# EAGLE design RP2040-Shim-2 (EAGLE 7.7.0)
COMPANY: ADAFRUIT INDUSTRIES; DRAWN: KTOWN; REV: B
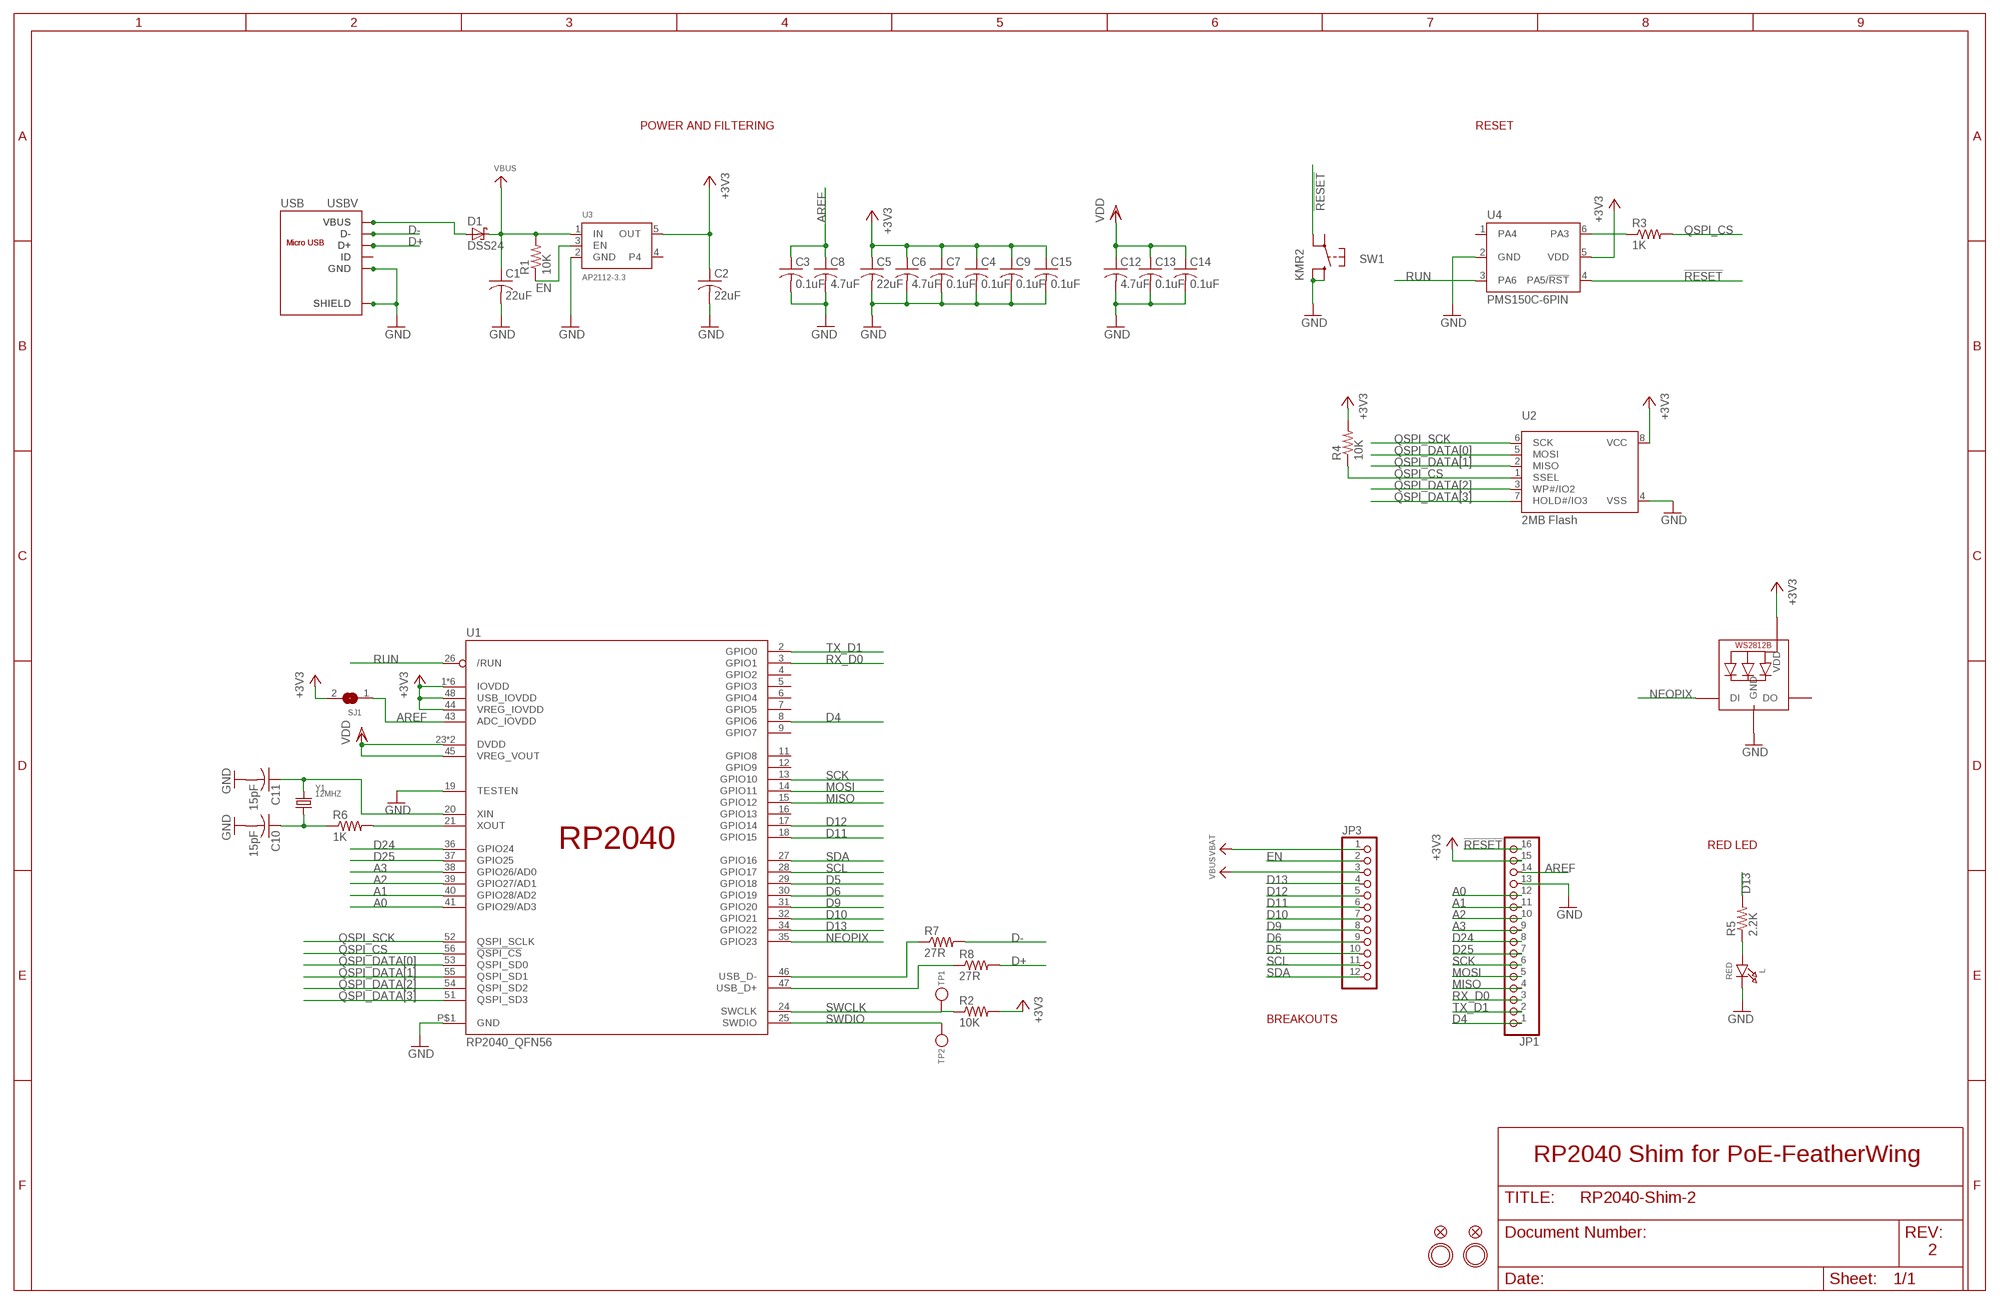
[diagram p0: schematic, sheet 1]

## Parts
C1  22uF  C-USC0805K  [C0805K]
C2  22uF  C-USC0805K  [C0805K]
C3  0.1uF  C-USC0402K  [C0402K]
C4  0.1uF  C-USC0402K  [C0402K]
C5  22uF  C-USC0805K  [C0805K]
C6  4.7uF  C-USC0402K  [C0402K]
C7  0.1uF  C-USC0402K  [C0402K]
C8  4.7uF  C-USC0402K  [C0402K]
C9  0.1uF  C-USC0402K  [C0402K]
C10  15pF  C-USC0402K  [C0402K]
C11  15pF  C-USC0402K  [C0402K]
C12  4.7uF  C-USC0402K  [C0402K]
C13  0.1uF  C-USC0402K  [C0402K]
C14  0.1uF  C-USC0402K  [C0402K]
C15  0.1uF  C-USC0402K  [C0402K]
D1  DSS24  [SOD123FL]
JP1  HEADER-1X16ROUND  [1X16_ROUND]
JP3  HEADER-1X12  [1X12_ROUND]
L  RED  LED0805_NOOUTLINE  [CHIPLED_0805_NOOUTLINE]
LED1  WS2812B3535  [LED3535]
R1  10K  R-US_R0402  [R0402]
R2  10K  R-US_R0402  [R0402]
R3  1K  R-US_R0402  [R0402]
R4  10K  R-US_R0402  [R0402]
R5  2.2K  R-US_R0402  [R0402]
R6  1K  R-US_R0402  [R0402]
R7  27R  R-US_R0402  [R0402]
R8  27R  R-US_R0402  [R0402]
SJ1  SOLDERJUMPERCLOSED  [SOLDERJUMPER_CLOSEDWIRE]
SW1  KMR2  SWITCH_TACT_SMT4.6X2.8  [BTN_KMR2_4.6X2.8]
TP1  TESTPOINTROUND1.5MM  [TESTPOINT_ROUND_1.5MM]
TP2  TESTPOINTROUND1.5MM  [TESTPOINT_ROUND_1.5MM]
U1  RP2040_QFN56  [QFN56_7MM_REDUCEDEPAD]
U2  2MB Flash  SPIFLASH_8PINUX  [USON8]
U3  AP2112-3.3  VREG_SOT23-5  [SOT23-5]
U4  PMS150C-6PIN  [SOT23-6]
U$31  MOUNTINGHOLE2.5  [MOUNTINGHOLE_2.5_PLATED]
U$32  MOUNTINGHOLE2.5  [MOUNTINGHOLE_2.5_PLATED]
U$34  FIDUCIAL_1MM  [FIDUCIAL_1MM]
U$35  FIDUCIAL_1MM  [FIDUCIAL_1MM]
USB  ZX62-B-5PA  MICRO-USB-SMD  [TS-1012E-AC03516]
USBV  MICRO-USB-SMD-VERT  [U-D-M5DS-W-4]
Y1  12MHZ  CRYSTAL2.5X2.0  [CRYSTAL_2.5X2]

## Nets
!RESET: JP1.16 SW1.A'(P1) U4.4(PA5/!RST)
+3V3 [power]: C2.1 C4.1 C5.1 C6.1 C7.1 C9.1 C15.1 JP1.15 LED1.2(VDD) R2.2 R4.2 SJ1.2 U1.1(IOVDD) U1.10(IOVDD) U1.22(IOVDD) U1.33(IOVDD) U1.42(IOVDD) U1.44(VREG_IOVDD) U1.48(USB_IOVDD) U1.49(IOVDD) U2.8(VCC) U3.5(OUT) U4.5(VDD)
A0: JP1.12 U1.41(GPIO29/AD3)
A1: JP1.11 U1.40(GPIO28/AD2)
A2: JP1.10 U1.39(GPIO27/AD1)
A3: JP1.9 U1.38(GPIO26/AD0)
AREF: C3.1 C8.1 JP1.14 SJ1.1 U1.43(ADC_IOVDD)
D4: JP1.1 U1.8(GPIO6)
D5: JP3.10 U1.29(GPIO18)
D6: JP3.9 U1.30(GPIO19)
D9: JP3.8 U1.31(GPIO20)
D10: JP3.7 U1.32(GPIO21)
D11: JP3.6 U1.18(GPIO15)
D12: JP3.5 U1.17(GPIO14)
D13: JP3.4 R5.2 U1.34(GPIO22)
D24: JP1.8 U1.36(GPIO24)
D25: JP1.7 U1.37(GPIO25)
D+: R8.2 USB.3(D+) USBV.3(D+)
D-: R7.2 USB.2(D-) USBV.2(D-)
EN: JP3.2 R1.1 U3.3(EN)
GND [gnd]: C1.2 C2.2 C3.2 C4.2 C5.2 C6.2 C7.2 C8.2 C9.2 C10.2 C11.2 C12.2 C13.2 C14.2 C15.2 JP1.13 L.C LED1.4(GND) SW1.B'(S1) SW1.B(S) U1.19(TESTEN) U1.P$1(GND) U2.4(VSS) U3.2(GND) U4.2(GND) USB.5(GND) USB.P1(SHIELD) USB.P2(SHIELD) USB.P3(SHIELD) USB.P4(SHIELD) USB.P5(SHIELD) USB.P6(SHIELD) USBV.5(GND) USBV.MNT1(SHIELD) USBV.MNT2(SHIELD) USBV.MNT3(SHIELD) USBV.MNT4(SHIELD)
MISO: JP1.4 U1.15(GPIO12)
MOSI: JP1.5 U1.14(GPIO11)
N$1: USB.4(ID) USBV.4(ID)
N$2: L.A R5.1
N$5: C10.1 R6.1 Y1.1
N$6: R6.2 U1.21(XOUT)
N$7: C11.1 U1.20(XIN) Y1.3
N$8: R8.1 U1.47(USB_D+)
N$9: R7.1 U1.46(USB_D-)
N$11: R3.1 U4.6(PA3)
NEOPIX: LED1.1(DI) U1.35(GPIO23)
QSPI_CS: R3.2 R4.1 U1.56(!QSPI_CS) U2.1(SSEL)
QSPI_DATA[0]: U1.53(QSPI_SD0) U2.5(MOSI)
QSPI_DATA[1]: U1.55(QSPI_SD1) U2.2(MISO)
QSPI_DATA[2]: U1.54(QSPI_SD2) U2.3(WP#/IO2)
QSPI_DATA[3]: U1.51(QSPI_SD3) U2.7(HOLD#/IO3)
QSPI_SCK: U1.52(QSPI_SCLK) U2.6(SCK)
RUN: U1.26(/RUN) U4.3(PA6)
RX_D0: JP1.3 U1.3(GPIO1)
SCK: JP1.6 U1.13(GPIO10)
SCL: JP3.11 U1.28(GPIO17)
SDA: JP3.12 U1.27(GPIO16)
SWCLK: R2.1 TP1.P$1 U1.24(SWCLK)
SWDIO: TP2.P$1 U1.25(SWDIO)
TX_D1: JP1.2 U1.2(GPIO0)
VBAT [power]: JP3.1
VBUS [power]: C1.1 D1.C JP3.3 R1.2 U3.1(IN)
VBUSEXT [power]: D1.A USB.1(VBUS) USBV.1(VBUS)
VDD: C12.1 C13.1 C14.1 U1.23(DVDD) U1.45(VREG_VOUT) U1.50(DVDD)
Unconnected: LED1.3(DO) SW1.A(P) U1.4(GPIO2) U1.5(GPIO3) U1.6(GPIO4) U1.7(GPIO5) U1.9(GPIO7) U1.11(GPIO8) U1.12(GPIO9) U1.16(GPIO13) U3.4 U4.1(PA4)

## Notes on the sheet
- POWER AND FILTERING | RESET
- RED LED
- BREAKOUTS
- RP2040 Shim for PoE-FeatherWing
- 2

## Library data of the parts
C1-C15 = rcl:C-US: CAPACITOR, American symbol
D1 = LiFePO4wered-ESP32:DSS24: DSS22-DSS225 https://datasheet.lcsc.com/szlcsc/DIYI-Elec-Tech-D24_C150988.pdf
JP1 = microbuilder:HEADER-1X16: PIN HEADER
JP3 = microbuilder:HEADER-1X12
L = microbuilder:LED: LED 0603 - 0603 Surface Mount Package 2mA: Green LED - Low Power (3.9mcd, 2ma, 1.7Vf) - Digikey: 475-2709-2-ND Orange LED - Low Power (9.8mcd, 2ma, 1.8Vf) - Digikey: 475-1194-2-ND Red LED - Low Power (5mcd, 2ma, 1.8Vf) - Digikey: 475-1195-2-ND Yellow LED - Low Power (7mcd, 2ma, 1.8Vf) - Digikey: 475-1196-2-ND 5mA: Blue LED - Low Power (17mcd, 5ma, 2.9Vf) - Digikey: LNJ937W8CRACT-ND 0805 - 0805 Surface Mount Package 2mA: Red LED (8.8mcd, 2mA, 1.8Vf, Clear) - Low Power [Digikey: 475-2510-1-ND] Green LED (5mcd, 2mA, 1.8Vf, Clear) - Low Power [Digikey: 475-2730-1-ND] Yellow LED (11.3mcd, 2mA, 1.8Vf, Clear) - Low Power [Digikey: 475-2555-1-ND] 20mA: Red LED (104mcd, 20mA, Diffused) - LS R976 [Digikey: 475-1278-6-ND] Red LED (12mcd, 20mA, 2.0Vf, Clear) - APT2012EC [Digikey: 754-1128-1-ND] Green LED (15mcd, 20mA, 2.2Vf, Clear) - APT2012GC [Digikey: 754-1131-1-ND] Orange LED (160mcd, 20mA, 2.1Vf, Clear) - APT2012SECK [Digikey: 754-1130-1-ND] 1206 - 1206 Surface Mount Package Green LED (26mcd, 20mA, Diffused) - LG N971 [Digikey: 475-1407-6-ND] Red LED (15mcd, 20mA, Diffused) - LH N974 [Digikey: 475-1416-6-ND] Cree - Cree High-Power Surface Mount LEDs XPEBWT-L1-0000-00D50 - White 111lm 350mA 2.9Vf 6200K 110° XTEAWT-00-0000-00000LEE3 - White 114lm 350mA 2.85Vf 5000K 115° Everlight - Everlight 45-21 Series Surface Mount LEDs 45-21/QK2C-B2832AC2CB2/2T - Warm White 2000mcd 20mA 3.25Vf 3050K 120° 45-21/LK2C-B38452C4CB2/2T - Nuetral White 2000mcd 20mA 3.25Vf 4150K 120° 45-21/LK2C-B50634C6CB2/2T - Cold White 2200mcd 20mA 3.25Vf 5650K 120° PLCC2 Reverse Mount LS T77K-J1L2-1-0-2-R18-Z - Red 11.25mcd 2mA 1.8Vf 630nm 120° LO T77K-L1M2-24-Z - Orange 19.6mcd 2mA 1.8Vf 606nm 120° LY T77K-K2M1-26-Z - Yellow 15.7mcd 2mA 1.8Vf 587nm 120°
LED1 = microbuilder:WS2812B
R1-R8 = rcl:R-US_: RESISTOR, American symbol
SJ1 = microbuilder:SOLDERJUMPER: SMD Solder JUMPER Solder the two pads together to create a connection, or remove the solder to break it. REFLOW - Use this footprint for solder paste and reflow ovens. WAVE - Use this footprint for hand-soldering (larger pads). CLOSED - Has a trace between the two pads to ensure it is closed by default. The trace needs to be cut to disable the jumper, and can be closed again by creating a solder bridge between the two pads.
SW1 = microbuilder:SWITCH_TACT_SMT: SMT Tact Switches 6x6mm - Digikey: P12940SCT-ND KMR2 (4.6x2.8mm) - Digikey: 401-1426-1-ND EVQ-PQHB55 - Light Touch, 160GF (4.5x4.5mm) - Digikey: P8090SCT-ND KMT0 - KMT021 NGJ LHS (etc.) IP68/Waterproof - Digikey: CKN10289CT-ND
TP1 TP2 = microbuilder:TESTPOINT: Test Point Various test points for characterisation and PCB testing TESTPOINT_SMT - Compact Surface Mount Test Point [Digikey: 5016KTR-ND]
U1 = adafruit_micro:RP2040
U2 = microbuilder:SPIFLASH_8PIN: SOIC8 SPI Flash Be careful with the size since SOIC8 flash comes in several 'widths' SOIC8 150 mil M25P16 - 16Mbit (2Mbit x 8) Serial Flash (75MHz SPI Bus), Supply: 2.7-3.6V Digikey: SOIC8 - M25P16-VMN6P-ND SOIC8 208 mil W25Q16BVSSIG - 16Mbit (2Mbit x 8) Serial Flash (104MHz SPI Bus), Supply: 2.7-3.6V Digikey: SOIC8 - W25Q16BVSSIG-ND
U3 = microbuilder:VREG_SOT23-5: SOT23-5 Fixed Voltage Regulators Part Current Out V Out V In V Dropout θJA (°C/W) TJ (°C) Digikey Part No. ADP121 150mA 3.3V 3.4-5.5V 0.09V @ 150mA -- -- ADP121-AUJZ33R7CT-ND ADP121 150mA 3.0V 3.1-5.5V 0.09V @ 150mA -- -- ADP121-AUJZ30R7CT-ND ADP122 300mA 3.3V 3.4-5.5V 0.085V @ 300mA -- -- ADP122AUJZ-3.3-R7CT-ND ADP1712 300mA 3.3V 3.5-5.5V 0.17V @ 300mA -- -- ADP1712AUJZ-3.3-R7TR-ND AP7311 (Low Cost) 150mA 3.3V 3.5-6V 0.15V @ 150mA -- -- AP7311-33WG-7DICT-ND LD39015M18R 150mA 1.8V 1.9V-5.5V 0.08V @ 100mA -- -- 497-6977-1-ND LP2985A-33DBVR 150mA 3.3V 3.3-16V 0.28V @ 150mA 206 150 296-18479-1-ND MCP1824T-3302E/OT 300mA 3.3V 3.5V-6V 0.2V @ 300mA -- -- MCP1824T-3302E/OTCT-ND MIC5205-2.5YM5 TR 150mA 2.5V 2.7-16V 0.165V @ 150mA -- -- 576-1257-2-ND MIC5205-3.0YM5 TR 150mA 3.0V 3.2V-16V 0.165V @ 150mA -- -- 576-1258-2-ND MIC5205-3.3YM5 TR 150mA 3.3V 3.5V-16V 0.165V @ 150mA -- -- 576-1259-2-ND TPS780330220 150mA 3.3V+2.2V 3.6-5.5V 250mV Max -- -- 296-23332-1-ND TDA3663/N1,135 100mA 3.3V 3.5-45V 0.18V @ 50mA -- -- 568-5343-1-ND Max operating temp can be calculated using θJA, TJ (max junction temperature), and power in watts. Set the "Maximum Ambient Temperature" until it reaches TJ ("Max Junction Temperature"), which is the absolute limit for safe use of the regulator: Heat Sink Temperature Calculator <http://www.daycounter.com/Calculators/Heat-Sink-Temperature-Calculator.phtml> For example, With 12V source into a 3.3V LP2985 and a 30mA load, we are dissipating (12V-3.3V) * 0.03A = 0.261W. With a θJA of 206 °C/W, a TJ of 150°C, and 261mW we can safely use the chip without a heat sink up to 75°C (=147.1°C Junction Temperature).
U4 = wESP32:PMS150C-6PIN: Padauk PMS150C SOT23-6 http://www.padauk.com.tw/upload/doc/PMS150C%20datasheet%20V105_EN_20181128.pdf
U$31 U$32 = microbuilder:MOUNTINGHOLE: Mounting Hole For #2 screws (0.086"/2.18mm width, 0.094"/2.4mm hole) use 2.5mm; BOM: EXCLUDE
U$34 U$35 = microbuilder:FIDUCIAL: Fiducial Alignment Points Various fiducial points for machine vision alignment.; BOM: EXCLUDE
USB = PoE-FeatherWing:MICRO-USB-SMD: 320010005; MPN: ZX62-B-5PA
USBV = PoE-FeatherWing:MICRO-USB-SMD: 320010005
Y1 = microbuilder:CRYSTAL: Crystals HC49UP - Surface Mount Crystal 4.0MHz 18pF +/-30ppm Surface Mount Crystal [Digikey: 535-9857-1-ND] 12.0 MHz Surface Mount Crystal [Digikey: 535-9869-6-ND] 25.0 MHz Surface Mount Crystal [Digikey: 535-9078-1-ND] 2.5 x 2.0mm - MEMs SMT Crystal 16.0 MHz 10pF 20ppm 2.5 x 2.0mm Crystal [Digikey -40-85°C: 535-10923-1-ND] 3.2 x 2.5mm - MEMs SMT Crystal 12.0 MHz 8pF 15ppm 3.2 x 2.5mm Crystal [Digikey: -10-70°C: 644-1047-1-ND -40-125°C: 644-1128-1-ND] 40~85°C cheaper: 644-1173-6-ND 16.0 MHz 8pF 15ppm 3.2 x 2.5mm Crystal [Digikey: -10-70°C: 644-1049-1-ND -40-125°C: 644-1129-2-ND]-40~85°C cheaper: 644-1175-6-ND 16.0 MHz 10pF 10ppm 3.2 x 2.5mm Crystal [Digikey: 644-1100-1-ND] 27.12 MHz 18pF 30ppm 3.2 x 2.5mm Crystal [Digikey: 887-1424-1-ND] 27.12MHz 10pF 10ppm 3.2 x 2.5mm Crystal [Digikey: 887-1329-1-ND] 4.9 x 1.8mm - MEMs SMT Crystal 32.768 KHz 12.5pF 20ppm 4.9 x 1.8mm Crystal [Digikey: SE2415CT-ND] 8.0 x 3.8mm - Surface Mount Crystal 32.768kHz 12.5pF 20ppm -40°C-85°C [Digikey: 535-9166-2-ND] Cylinder 32.768KHz Cylinder Crystal (2x6mm body) [Ex. Digikey: 300-8341-2-ND]

## Net classes
1 power: width 0.305 mm
2 gnd: width 0.254 mm

## Board
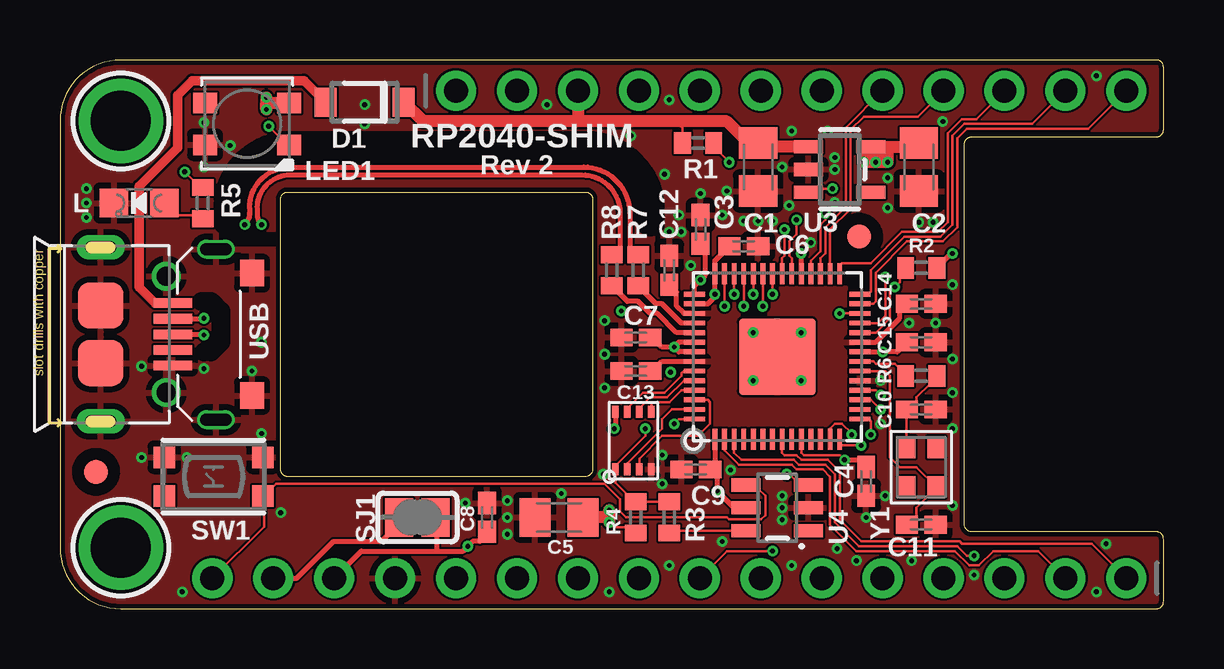
[diagram p1: board, top side]
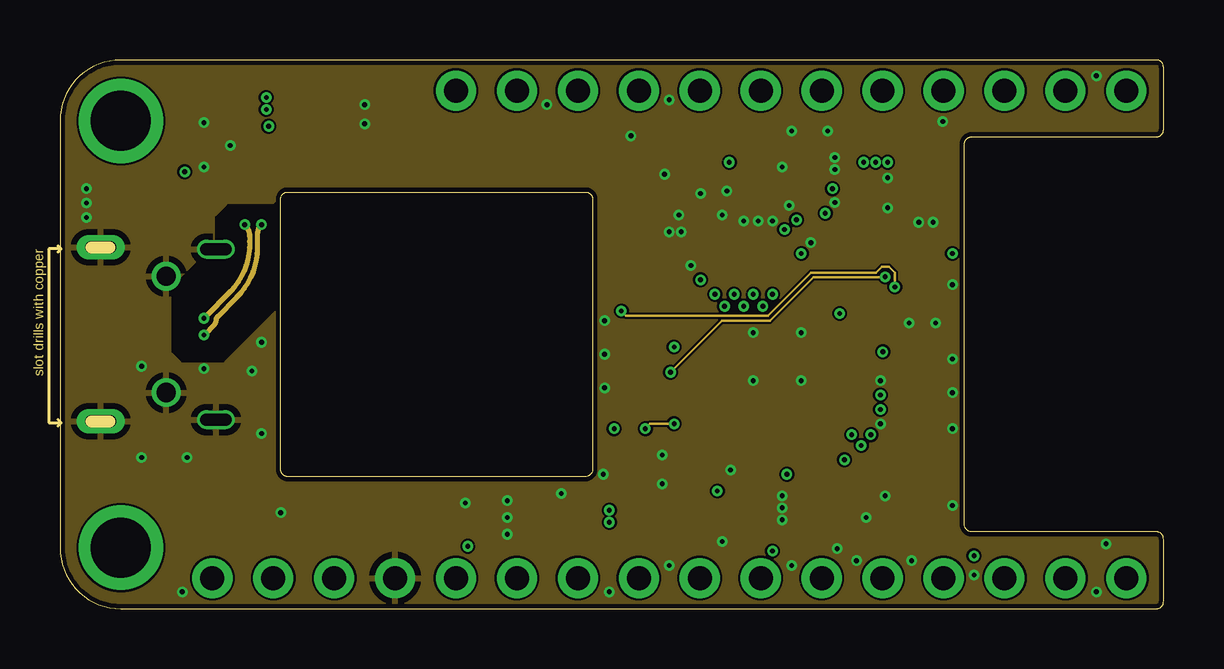
[diagram p2: board, inner layer Route2]
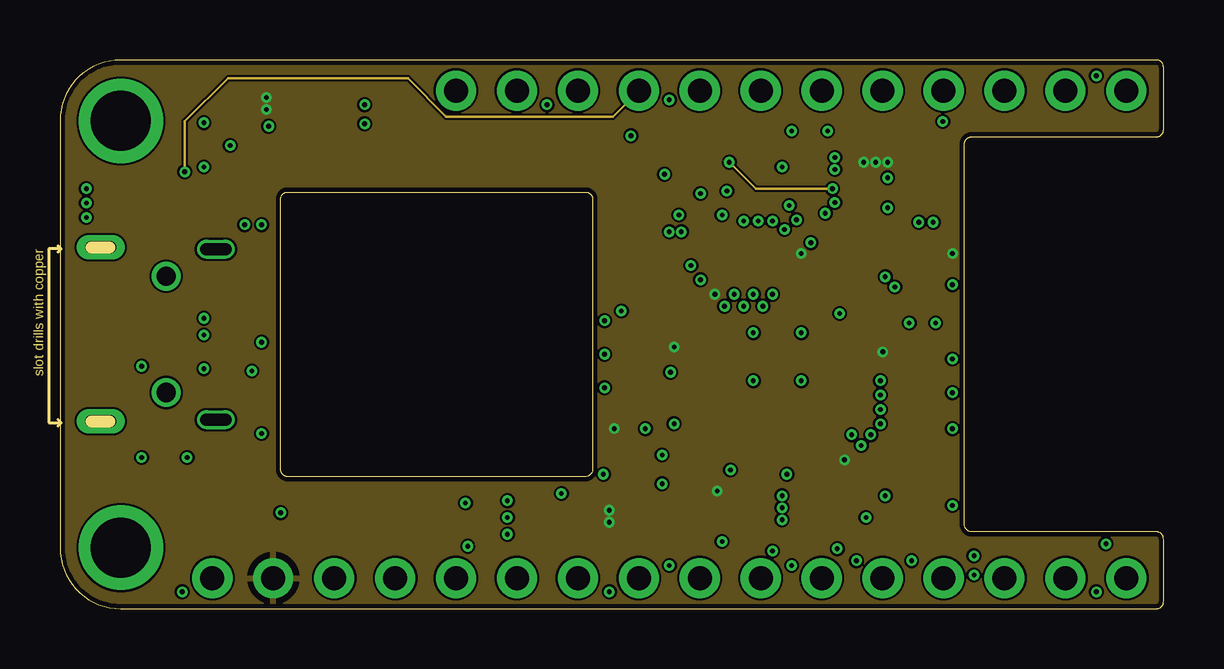
[diagram p3: board, inner layer Route3]
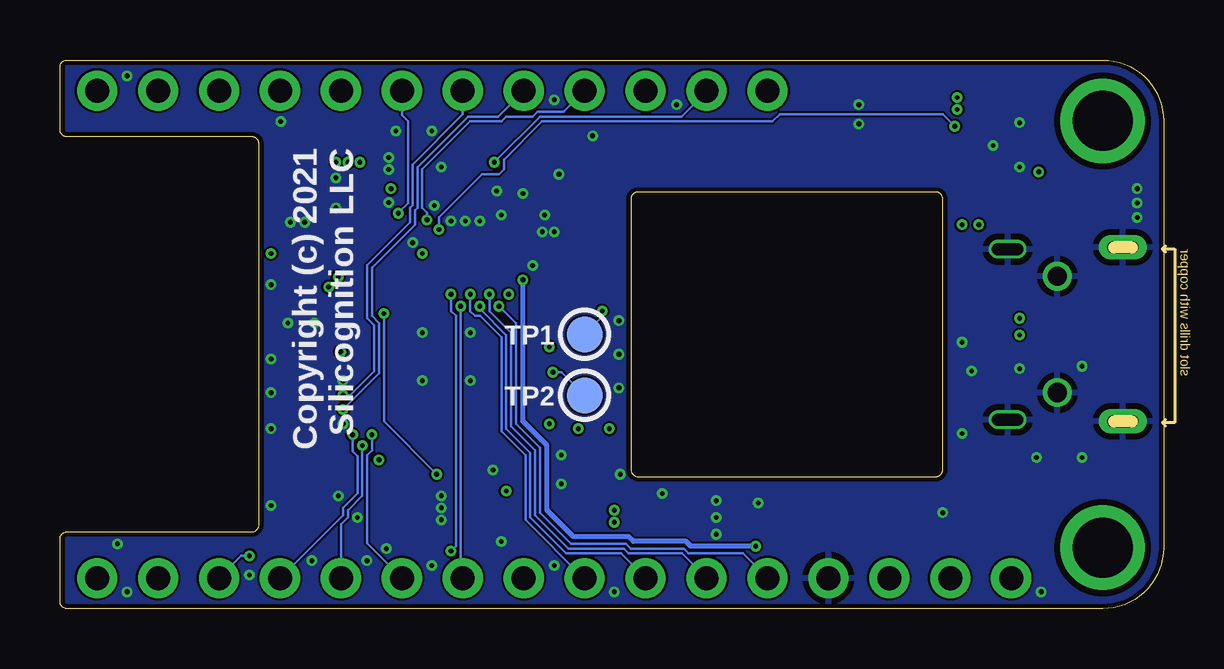
[diagram p4: board, bottom side, seen from below]

Size 46 x 22.86 mm. Coordinates in mm from the lower left corner, seen from the top.
Outline: 45.7,22.86 2.54,22.86 arc90 0,20.32 0,2.54 arc90 2.54,0 45.7,0 arc90 46,0.3 46,2.9 arc90 45.7,3.2 38,3.2 arc-90 37.7,3.5 37.7,19.36 arc-90 38,19.66 45.7,19.66 arc90 46,19.96 46,22.56 arc90 45.7,22.86
Outline: 21.9,5.5 9.5,5.5 arc-90 9.2,5.8 9.2,17.06 arc-90 9.5,17.36 21.9,17.36 arc-90 22.2,17.06 22.2,5.8 arc-90 21.9,5.5
Copper layers (1+2*3+16): Top 0.035mm / dielectric 0.24mm / Route2 0.017mm / dielectric 1mm / Route3 0.017mm / dielectric 0.24mm / Bottom 0.035mm
Design rules "default-4-layer *": minimum track width 3.5mil, minimum drill 0.2mm, track to track 3.5mil, track to pad 5mil, pad to pad 5mil, via to via 5mil, smd to smd 3.5mil, copper to edge 0.2mm, drill to drill 0.1mm, minimum pad ring 3mil, minimum via ring 0.12mm, stop-mask expansion 4mil, vias tented up to drill 20mil, thermal gap 10mil
tRestrict: 16 lines

### Footprints (pad centres in the part's own frame; a part is rotated, then mirrored left to right if it is on the bottom)
C0805K = smd 1.3 x 1.6: 1 -1,0; 2 1,0
C0402K = smd 0.925 x 0.74: 1 -0.6,0; 2 0.6,0
SOD123FL = smd 0.91 x 1.22: A 1.625,0; C -1.625,0
1X16_ROUND = drill 1 pad 1.676: 1 -19.05,0; 2 -16.51,0; 3 -13.97,0; 4 -11.43,0; 5 -8.89,0; 6 -6.35,0; 7 -3.81,0; 8 -1.27,0; 9 1.27,0; 10 3.81,0; 11 6.35,0; 12 8.89,0; 13 11.43,0; 14 13.97,0; 15 16.51,0; 16 19.05,0
1X12_ROUND = drill 1 pad 1.676: 1 -13.97,0; 2 -11.43,0; 3 -8.89,0; 4 -6.35,0; 5 -3.81,0; 6 -1.27,0; 7 1.27,0; 8 3.81,0; 9 6.35,0; 10 8.89,0; 11 11.43,0; 12 13.97,0
CHIPLED_0805_NOOUTLINE = smd 1.2 x 1.2: A 0,-1.05; C 0,1.05
LED3535 = smd 1 x 0.85: 1 -1.75,0.875; 2 -1.75,-0.875; 3 1.75,-0.875; 4 1.75,0.875
R0402 = smd 0.7 x 0.9: 1 -0.65,0; 2 0.65,0
SOLDERJUMPER_CLOSEDWIRE = smd 1.168 x 1.6: 1 -0.762,0; 2 0.762,0 | smd 0.635 x 0.203: WIRE 0,0
BTN_KMR2_4.6X2.8 = smd 0.9 x 0.9: A 2.05,0.8; A' -2.05,0.8; B 2.05,-0.8; B' -2.05,-0.8
TESTPOINT_ROUND_1.5MM = smd 1.5 x 1.5: P$1 0,0
QFN56_7MM_REDUCEDEPAD = smd 0.875 x 0.2: 1 -3.45,2.6; 2 -3.45,2.2; 3 -3.45,1.8; 4 -3.45,1.4; 5 -3.45,1; 6 -3.45,0.6; 7 -3.45,0.2; 8 -3.45,-0.2; 9 -3.45,-0.6; 10 -3.45,-1; 11 -3.45,-1.4; 12 -3.45,-1.8; 13 -3.45,-2.2; 14 -3.45,-2.6; 29 3.45,-2.6; 30 3.45,-2.2; 31 3.45,-1.8; 32 3.45,-1.4; 33 3.45,-1; 34 3.45,-0.6; 35 3.45,-0.2; 36 3.45,0.2; 37 3.45,0.6; 38 3.45,1; 39 3.45,1.4; 40 3.45,1.8; 41 3.45,2.2; 42 3.45,2.6 | smd 0.2 x 0.875: 15 -2.6,-3.45; 16 -2.2,-3.45; 17 -1.8,-3.45; 18 -1.4,-3.45; 19 -1,-3.45; 20 -0.6,-3.45; 21 -0.2,-3.45; 22 0.2,-3.45; 23 0.6,-3.45; 24 1,-3.45; 25 1.4,-3.45; 26 1.8,-3.45; 27 2.2,-3.45; 28 2.6,-3.45; 43 2.6,3.45; 44 2.2,3.45; 45 1.8,3.45; 46 1.4,3.45; 47 1,3.45; 48 0.6,3.45; 49 0.2,3.45; 50 -0.2,3.45; 51 -0.6,3.45; 52 -1,3.45; 53 -1.4,3.45; 54 -1.8,3.45; 55 -2.2,3.45; 56 -2.6,3.45 | smd 3.2 x 3.2: P$1 0,0
USON8 = smd 0.5 x 0.275: 1 -1.2,0.75; 2 -1.2,0.25; 3 -1.2,-0.25; 4 -1.2,-0.75; 5 1.2,-0.75; 6 1.2,-0.25; 7 1.2,0.25; 8 1.2,0.75
SOT23-5 = smd 0.55 x 1.2: 1 -0.95,-1.3; 2 0,-1.3; 3 0.95,-1.3; 4 0.95,1.3; 5 -0.95,1.3
SOT23-6 = smd 0.55 x 1.2: 1 0.95,1.3; 2 0,1.3; 3 -0.95,1.3; 4 -0.95,-1.3; 5 0,-1.3; 6 0.95,-1.3
MOUNTINGHOLE_2.5_PLATED = drill 2.5 pad 3.2: P$1 0,0
FIDUCIAL_1MM = smd 1 x 1: 1 0,0
TS-1012E-AC03516 = smd 0.4 x 1.35: 1 -1.3,2.875; 2 -0.65,2.875; 3 0,2.875; 4 0.65,2.875; 5 1.3,2.875 | smd 1.9 x 1.9: P1 -1.2,0; P2 1.2,0 | drill 0.508 pad 1.016 long: P3 -3.625,0; P4 3.625,0 | drill 0.8: P5 -2.425,2.73; P6 2.425,2.73
U-D-M5DS-W-4 = smd 1.6 x 0.4: 1 -1.5,1.3; 2 -1.5,0.65; 3 -1.5,0; 4 -1.5,-0.65; 5 -1.5,-1.3 | drill 0.5 pad 0.8 long: MNT1 0.3,-3.55; MNT2 0.3,3.55 | smd 1 x 1.1: MNT3 1.8,-2.55; MNT4 1.8,2.55
CRYSTAL_2.5X2 = smd 0.9 x 0.75: 1 -0.825,-0.625; 2 0.825,-0.625; 3 0.825,0.625; 4 -0.825,0.625

### Placement (x,y rotation side)
C1  29.1,18.4 270 top
C2  35.8,18.4 270 top
C3  26.7,15.8 90 top
C4  33.6,5.3 270 top
C5  20.8,3.8 180 top
C6  28.5,15.1 0 top
C7  24,11.3 180 top
C8  17.8,3.8 90 top
C9  26.5,5.8 180 top
C10  35.9,8.3 0 top
C11  35.9,3.5 0 top
C12  25.4,14.1 90 top
C13  24,9.9 180 top
C14  35.9,12.7 0 top
C15  35.9,11.1 0 top
D1  12.7,21.1 180 top
JP1  25.4,1.27 180 top
JP3  30.48,21.58 0 top
L  3.3,16.9 90 top
LED1  7.8,20.2 180 top
R1  26.6,19.4 180 top
R2  35.9,14.2 0 top
R3  25.4,3.8 90 top
R4  24,3.8 270 top
R5  5.95,16.9 90 top
R6  35.9,9.7 180 top
R7  24.1,14.1 90 top
R8  23,14.1 90 top
SJ1  14.9,3.8 180 top
SW1  6.4,5.5 180 top
TP1  24.13,11.43 0 bottom
TP2  24.13,8.89 0 bottom
U1  29.9,10.5 90 top
U2  23.9,7 90 top
U3  32.5,18.3 270 top
U4  29.9,4.2 270 top
U$31  2.54,20.32 0 top
U$32  2.54,2.54 0 top
U$34  33.31,15.5 0 top
U$35  1.5,5.7 0 top
USB  1.7,11.43 270 top
USBV  6.2,11.43 0 top
Y1  35.9,5.9 270 top

### Tracks (layer width: path | path; a pad name or v marks a point on that pad's centre or on a via)
!RESET
  Top 0.1: JP1.16 8.5,3.42 8.5,4.65 | SW1.A' 8.5,4.65 | 8.5,4.65 8.5,4.7 9,5.2 22.7,5.2 23.35,4.55 23.35,4.05 23.6,3.8 27.8,3.8 27.88,3.73 29.23,3.73 29.4,3.9 29.4,4.7 29.1,5 28.75,5 U4.4
+3V3  (via drill 0.2)
  Top 0.1: R4.2 23.95,3.15 23.7,3.4 23.1,3.4 v22.9,3.6 | U1.10 30.9,6.5 31,6.4 32.5,6.4 v32.7,6.2
  Top 0.2: v25.6,10.9 25.1,10.9 24.7,11.3 C7.1 | U1.49 25.8,10.7 v25.6,10.9 | U1.48 25.8,11.1 v25.6,10.9 | C6.1 27.3,14.5 U1.42 v27.3,13.1 27.3,13 27,12.7 U1.44 | U1.1 27.3,6 C9.1 27.4,5.5 v27.4,4.9 28.1,4.2 U4.5 | U2.8 23.15,7.55 v23.1,7.5 | U1.33 v30.9,14.8 | U1.22 v34.3,10.7 34.9,10.7 C15.1 | R2.2 37.15,14.8 v37.2,14.8 | v32.7,6.2 33.3,6.2 C4.1 | JP1.15 9.87,1.27 11.4,2.8 13.4,2.8 13.8,3.2 13.8,3.46 SJ1.2
  Top 0.5: C2.1 35.65,19.25 U3.5 34,19.05 v34,18.6 | 33.5,19.2 v33.5,18.6 v34.5,18.6 34.5,19.2 | v8.6,21.3 v8.6,20.8 8.6,21.07 LED1.2 | v22.9,3.6 22.9,3.8 | v22.9,4.1 22.9,3.8 | 22.9,3.8 C5.1
  pour Route3 (rank 5): 0,0 46,0 46,22.9 0,22.9
A0  (via drill 0.2)
  Top 0.1: U1.41 v27.7,12.6
  Bottom 0.1: JP1.12 17.54,2.3 19.8,2.3 20,2.5 22.2,2.5 22.4,2.7 24.7,2.7 26,4 26,6.7 27,7.7 27,11.9 v27.7,12.6
A1  (via drill 0.2)
  Top 0.1: U1.40 v28.1,13.1
  Bottom 0.1: JP1.11 20.08,2.3 22.3,2.3 22.5,2.5 24.8,2.5 26.2,3.9 26.2,6.6 27.2,7.6 27.2,11.5 28.1,12.4 v28.1,13.1
A2  (via drill 0.2)
  Top 0.1: U1.39 v28.5,12.6
  Bottom 0.1: JP1.10 22.62,2.3 24.9,2.3 26.4,3.8 26.4,6.5 27.4,7.5 27.4,11.4 28.5,12.5 v28.5,12.6
A3  (via drill 0.2)
  Top 0.1: U1.38 v28.9,13.1
  Bottom 0.1: JP1.9 24.17,1.27 26.6,3.7 26.6,6.4 27.6,7.4 27.6,11.3 28.5,12.2 28.7,12.2 28.9,12.4 v28.9,13.1
AREF  (via drill 0.2)
  Top 0.2: JP1.14 12.56,2.4 15.7,2.4 | 15.7,2.4 16.8,2.4 v17,2.6 17.2,2.8 17.5,2.8 17.8,3.1 C8.1 | SJ1.1 15.7,3.76 15.7,2.4 | C3.1 26.9,15.2 26.9,13.9 v26.7,13.7 26.45,13.45 U1.43
  Bottom 0.2: v17,2.6 19.7,2.6 19.9,2.8 22.1,2.8 22.3,3 24.6,3 25.7,4.1 25.7,6.8 26.7,7.8 v26.7,13.7
D4
  Top 0.1: JP1.1 43.02,2.7 37.6,2.7 37.5,2.8 33.4,2.8 32.5,3.7 32.5,5.7 32,6.2 30.9,6.2 30.7,6.4 30.2,6.4 30.1,6.5 U1.8
D5
  Top 0.1: JP3.10 38.19,20.4 37.6,20.4 37,19.8 37,16.1 36.6,15.7 35.1,15.7 33.8,14.4 32.6,14.4 32.5,14.3 U1.29
D6
  Top 0.1: JP3.9 35.75,20.5 33.5,20.5 32.95,19.95 32.95,16.65 32.1,15.8 U1.30
D9
  Top 0.1: JP3.8 32.75,20.04 32.75,16.75 31.9,15.9 31.9,14.8 31.7,14.6 U1.31
D10  (via drill 0.2)
  Top 0.1: v31.9,16.48 31.9,16.2 31.7,16 31.7,14.9 31.3,14.5 U1.32
  Bottom 0.1: JP3.7 31.75,20.55 31.5,20.3 31.5,16.9 31.9,16.5 v31.9,16.48
D11  (via drill 0.2)
  Top 0.1: U1.18 34,9.1 v34.2,8.9
  Bottom 0.1: JP3.6 29.21,20.59 31.3,18.5 31.3,16.8 31.4,16.7 31.4,16.1 33.2,14.3 33.2,12.1 32.9,11.8 32.9,9.9 33.9,8.9 v34.2,8.9
D12  (via drill 0.2)
  Top 0.1: U1.17 33.8,8.7 v34.2,8.3
  Bottom 0.1: JP3.5 27.75,20.5 29,20.5 31.1,18.4 31.1,16.7 31.2,16.6 31.2,16 33,14.2 33,12.2 32.7,11.9 32.7,9.8 v34.2,8.3
D13  (via drill 0.2)
  Top 0.1: v5.2,18.2 5.85,17.55 R5.2 | v30.7,16.2 30.7,15.6 30.4,15.3 30.4,14.7 30.5,14.6 U1.34
  Route3 0.1: JP3.4 23.05,20.5 16.1,20.5 14.5,22.1 7,22.1 5.2,20.3 v5.2,18.2
  Bottom 0.1: JP3.4 25.01,20.7 26.1,20.7 26.3,20.5 27.4,20.5 27.6,20.3 28.9,20.3 30.9,18.3 30.9,16.7 30.7,16.5 v30.7,16.2
D24  (via drill 0.2)
  Top 0.1: U1.36 v29.7,13.1 | JP1.8 27.8,2.4 v29.7,2.4
  Bottom 0.1: v29.7,2.4 29.5,2.6 29.5,12.2 29.7,12.4 v29.7,13.1
D25  (via drill 0.2)
  Top 0.1: U1.37 v29.3,12.6
  Bottom 0.1: JP1.7 29.3,1.36 v29.3,12.6
D+  (via drill 0.2)
  Top 0.2: v8.4,16 arc-45 8.22,16.42 8.22,16.7 arc-90 9.6,18.07 21.75,18.07 arc-90 23.35,16.48 23.35,14.75 R8.2 | v6,11.4 5.97,11.43 USBV.3 USB.3
  Route2 0.2: v8.4,16 arc45 8.22,15.58 8.22,15.07 arc-45 7.35,12.95 6.57,12.17 arc45 6.5,12 arc-45 6.43,11.83 v6,11.4
D-  (via drill 0.2)
  Top 0.2: v7.7,16 arc45 7.9,16.48 7.9,16.7 arc-90 9.6,18.4 21.82,18.4 arc-90 23.75,16.48 23.75,14.75 R7.2 | v6,12.1 5.98,12.08 USBV.2 USB.2
  Top 0.35: 4.59,12.1 USB.2
  Route2 0.2: v7.7,16 arc-45 7.9,15.52 7.9,15.3 arc-45 7.12,13.22 v6,12.1
EN  (via drill 0.2)
  Top 0.1: R1.1 27.5,19.15 27.5,19 v27.9,18.6 | U3.3 31.35,17.5 v32.2,17.5
  Route3 0.1: v27.9,18.6 29,17.5 v32.2,17.5
  Bottom 0.1: v27.9,18.6 26,20.5 20.1,20.5 19.05,21.55 JP3.2
GND  (via drill 0.2, 0.5)
  Top 0.2: v28.9,9.5 U1.P$1
  other vias: 9.2,4 34.5,17.95 34.5,16.7 32.3,18.3 35.8,16.1 7.1,19.3 6,20.25 6,18.4 1.1,16.9 1.1,17.5 1.1,16.3 30.1,18.4 30.4,16.8 6,10 3.4,10.1 29.1,16.15 29.7,16.15 36.4,16.1 16.9,4.4 18.65,3.8 18.65,4.5 18.65,3.1 32.3,16.93 32.3,18.8 30.5,19.9 36.8,20.3 32,19.9 12.7,20.2 20.3,21 43.2,22.2 5.1,0.7 22.9,0.7 43.2,0.7 30.5,1.8 25.4,1.8 8.4,11.1 1.7,15.05 1.7,7.8 1.8,7.8 1.9,7.8 2,7.8 2.1,7.8 1.6,7.8 1.5,7.8 1.4,7.8 1.3,7.8 1.8,15.05 1.9,15.05 2,15.05 2.1,15.05 1.6,15.05 1.5,15.05 1.4,15.05 1.4,15.05 1.3,15.05 6.5,7.88 6.4,7.88 6.3,7.88 6.2,7.88 6.1,7.88 6.6,7.88 6.7,7.88 6.8,7.88 6.9,7.88 6.5,14.98 6.4,14.98 6.3,14.98 6.2,14.98 6.1,14.98 6.6,14.98 6.7,14.98 6.8,14.98 6.9,14.98 8.4,7.3 3.4,6.3 5.3,6.3 8,9.9 36.5,11.9 37.2,13.5 37.2,10.4 37.2,9 37.2,7.5 37.2,4.3 34.2,9.5 30.9,9.5 30.9,11.5 28.9,11.5 22.7,10.6 22.7,9.2 22.7,12 26.3,14.3 25.9,15.7 25.4,15.7 25.8,16.4 26.7,17.3 27.6,16.4 27.8,17.4 28.5,16.15 23.8,19.7 25.2,18.1 25.1,6.4 25.1,5.2 34.4,4.7 33.6,3.8 30.1,4.2 12.7,21 31.3,15.25 34.2,7.7 43.6,2.7 33.2,2 35.5,2 38.1,1.4 35.4,11.9 27.95,5.78 22.65,5.6 20.9,4.8 32.4,2.5 27.6,2.8 25.4,21.2 30.1,3.7 30.1,4.7
  pour Top (rank 5): 0,0 46,0 46,22.9 0,22.9
  pour Route2 (rank 5): 0,0 46,0 46,22.9 0,22.9
  pour Bottom (rank 5): 0,0 46,0 46,22.9 0,22.9
MISO  (via drill 0.2)
  Top 0.1: U1.15 33.7,7.9 33.8,7.8 v33.8,7.25
  Bottom 0.1: JP1.4 34.2,3.9 34.2,4.2 33.6,4.8 33.6,6.35 33.8,6.55 v33.8,7.25
MOSI  (via drill 0.2)
  Top 0.1: v33.4,6.8 32.5,6.8 U1.14
  Bottom 0.1: v33.4,6.8 33.4,4.7 34,4.1 34,3.8 34.29,3.51 JP1.5
N$1
  Top 0.2: USB.4 USBV.4
N$2
  Top 0.1: R5.1 5.8,16.4 4.8,16.4 4.35,16.85 L.A
N$4
  cutout Route2: 9.1,17 8.9,16.8 7,16.8 6.5,16.3 6.5,15.2 4.7,13.4 4.7,10.7 5.1,10.3 6.8,10.3 9.1,12.6
N$5
  Top 0.1: R6.1 36.3,9.45 36.3,9.4 35.7,8.8 35.7,8.6 35.4,8.3 | 35.4,8.3 C10.1 | 35.4,8.3 35.27,8.18 Y1.1
N$6
  Top 0.1: U1.21 33.9,10.3 34,10.2 34.8,10.2 35.25,9.75 R6.2
N$7
  Top 0.1: U1.20 34.4,9.9 34.6,9.7 34.6,6.3 35,5.9 35.7,5.9 Y1.3 36.2,4.75 36.2,4.7 35.7,4.2 35.7,3.8 35.4,3.5 C11.1
N$8
  Top 0.2: U1.47 25.7,11.5 24.9,12.3 24.6,12.3 24.1,12.8 23.65,12.8 R8.1
N$9
  Top 0.2: U1.46 25.9,11.9 25.1,12.7 24.85,12.7 R7.1
N$11
  Top 0.1: U4.6 25.5,3.25 R3.1
NEOPIX  (via drill 0.2)
  Top 0.1: LED1.1 9.47,19.32 v8.7,20.1 | v30.2,15.8 30.2,14.7 30.1,14.6 U1.35
  Bottom 0.1: v8.7,20.1 9.2,20.6 16,20.6 16.3,20.3 25.9,20.3 27.5,18.7 27.5,18.3 27.7,18.1 28.4,18.1 30.2,16.3 v30.2,15.8
QSPI_CS  (via drill 0.2)
  Top 0.1: U1.56 25.8,7.9 v25.6,7.7 | v24.4,7.5 24.4,7.2 23.15,5.95 U2.1 23.15,5.25 23.95,4.45 R4.1 R3.2
  Route2 0.1: v25.6,7.7 24.6,7.7 v24.4,7.5
QSPI_DATA[0]
  Top 0.1: U2.5 24.65,8.55 24.7,8.6 25.4,8.6 25.9,9.1 U1.53
QSPI_DATA[1]
  Top 0.1: U1.55 25.5,8.3 25.1,7.9 25.1,7.5 23.65,6.05 U2.2
QSPI_DATA[2]
  Top 0.1: U2.3 24.15,6.25 25.1,7.2 26.6,7.2 27.1,7.7 27.1,8.6 27,8.7 U1.54
QSPI_DATA[3]
  Top 0.1: U2.7 23.65,8.35 24.3,9 25.2,9 25.9,9.7 25.9,9.8 26,9.9 U1.51
QSPI_SCK
  Top 0.1: U2.6 24.15,8.35 24.6,8.8 25.3,8.8 26,9.5 U1.52
RUN  (via drill 0.2)
  Top 0.1: v30.3,5.6 30.4,5.6 30.7,5.3 31.05,5.3 U4.3 | U1.26 v32.5,12.3
  Bottom 0.1: v30.3,5.6 32.5,7.8 v32.5,12.3
RX_D0  (via drill 0.2)
  Top 0.1: U1.3 28.1,6.5 28.4,6.2 30.6,6.2 30.8,6 31.9,6 32.3,5.6 32.3,3.6 33.3,2.6 37.4,2.6 37.8,2.2 v38.1,2.2
  Bottom 0.1: JP1.3 38.44,2.2 v38.1,2.2
SCK  (via drill 0.2)
  Top 0.1: v33,7.25 33,7.3 32.6,7.7 32.3,7.7 32.1,7.5 U1.13
  Bottom 0.1: JP1.6 33.2,2.72 33.2,6.4 33,6.6 v33,7.25
SCL
  Top 0.1: JP3.11 40.53,20.2 37.7,20.2 37.2,19.7 37.2,16 36.7,15.5 35.2,15.5 33.8,14.1 33.8,13.2 33.7,13.1 U1.28
SDA
  Top 0.1: JP3.12 42.87,20 37.8,20 37.4,19.6 37.4,15.9 36.8,15.3 35.3,15.3 34,14 34,12.8 33.9,12.7 U1.27
SWCLK  (via drill 0.2)
  Top 0.1: U1.24 34,11.5 34.6,12.1 34.6,13.2 v34.8,13.4 35,13.6 35,13.95 R2.1
  Route2 0.1: v23.4,12.4 23.6,12.2 29.5,12.2 31.3,14 34,14 34.25,14.25 34.55,14.25 34.8,14 v34.8,13.4
  Bottom 0.1: TP1.P$1 23.4,12.16 v23.4,12.4
SWDIO  (via drill 0.2)
  Top 0.1: U1.25 34.1,11.9 34.4,12.2 v34.4,13.82
  Route2 0.1: v25.45,9.85 27.6,12 29.6,12 31.4,13.8 34.38,13.8 v34.4,13.82
  Bottom 0.1: TP2.P$1 25.09,9.85 v25.45,9.85
TX_D1
  Top 0.1: JP1.2 40.78,2.4 38.9,2.4 38.3,1.8 37.9,1.8 37.3,2.4 33.2,2.4 32.1,3.5 32.1,5.5 31.8,5.8 30.7,5.8 30.5,6 28.3,6 27.7,6.6 U1.2
VBUS
  Top 0.1: R1.2 25.95,20.3 25.9,20.3
  Top 0.5: U3.1 29.15,19.25 C1.1 28.8,19.3 27.8,20.3 25.9,20.3 21.5,20.3 | 21.5,20.3 15.12,20.3 D1.C | JP3.3 21.59,20.39 21.5,20.3
VBUSEXT
  Top 0.3: USB.1 USBV.1
  Top 0.4: USB.1 3.97,12.73 3.3,13.4 3.3,17.6 4.9,19.2 4.9,21.4 5.5,22 10.18,22 D1.A
VDD
  Top 0.2: C13.1 24.7,9.9 25.1,10.3 U1.50 | U1.45 26,12.3 25.7,12.6 25.7,13.2 C12.1 | U1.23 34,11.1 35,12.1 35,12.5 35.2,12.7 C14.1
  pour Top: 32.5,13.6 33,13.1 33,7.9 32.5,7.4 27.3,7.4 26.8,7.9 26.8,13.1 27.3,13.6

### Text on the board
tPlace: RP2040-SHIM | Rev 2
bPlace: Copyright (c) 2021 / Silicognition LLC